# Altium schematic sheet Stack_Rduino-SAMD_V2-PRO_2021-01-03_21-24-34.schdoc
size 321 x 219 mm
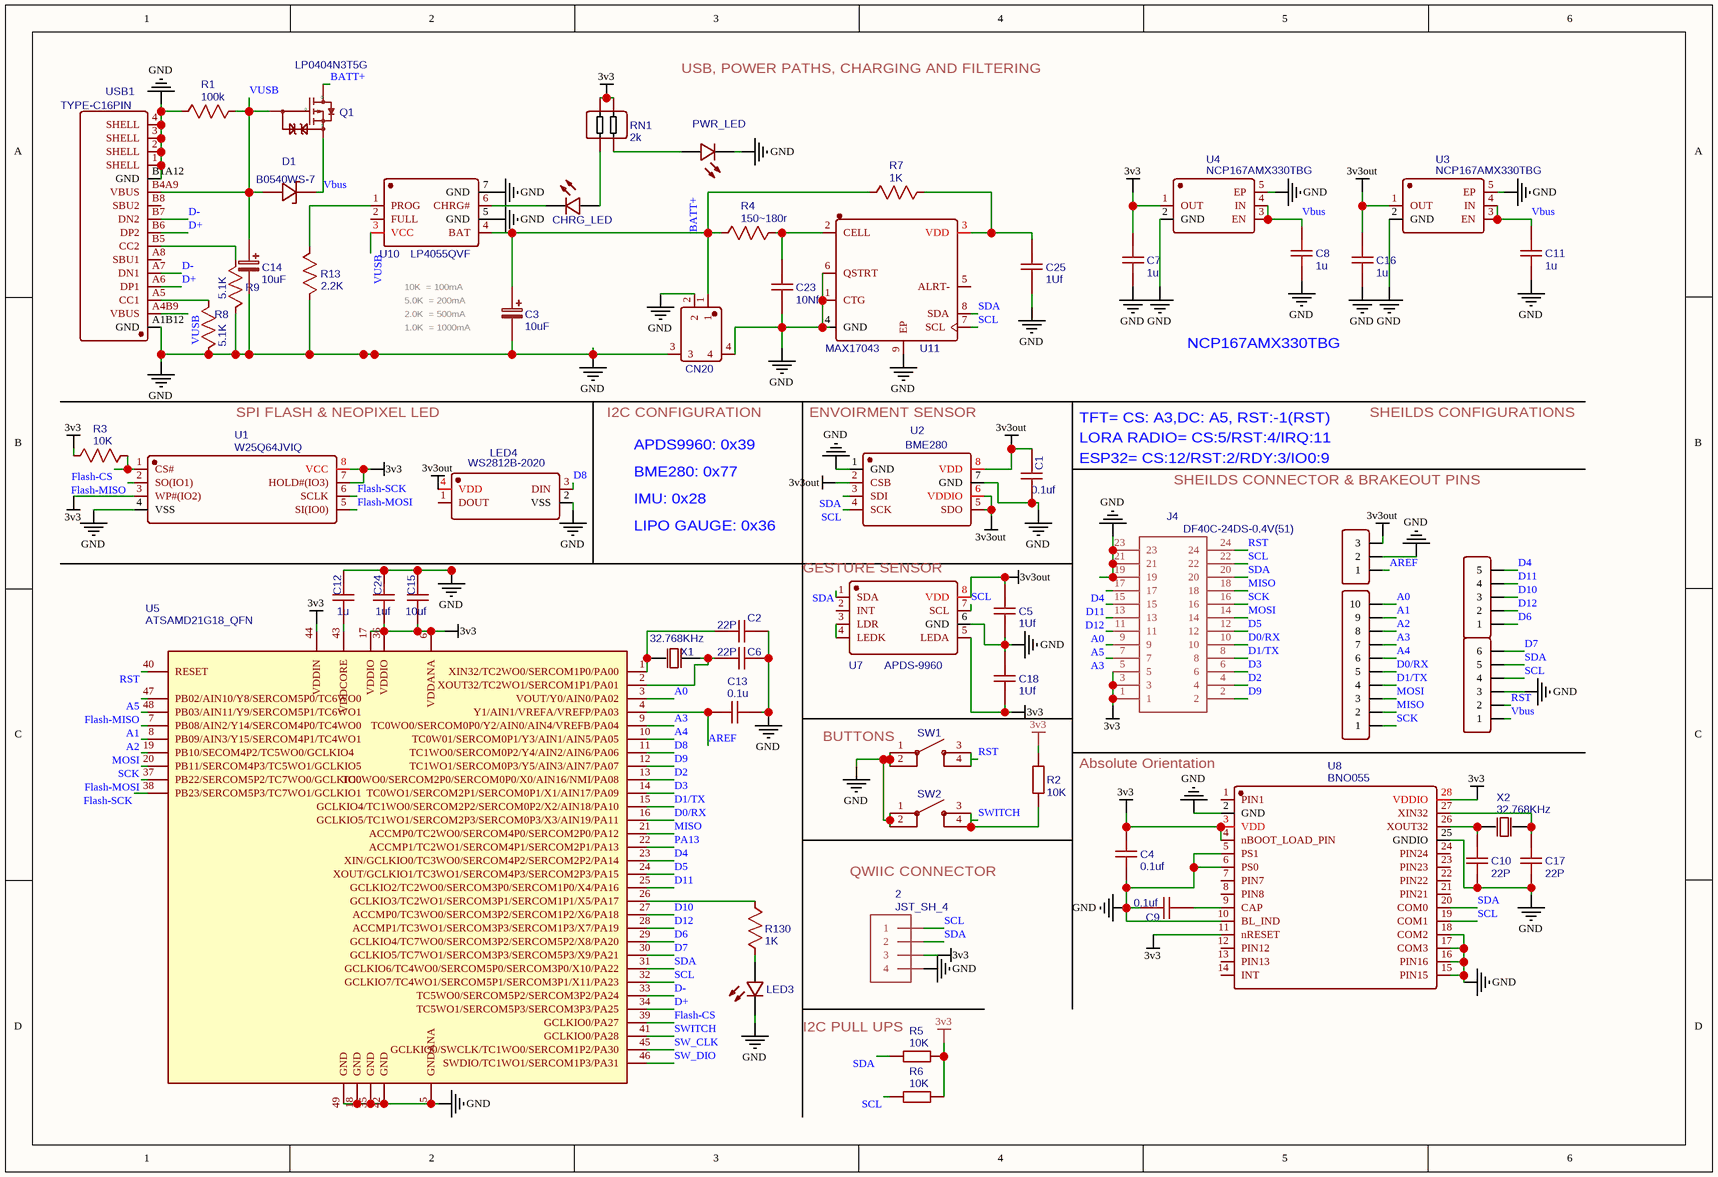
[diagram p0: Stack_Rduino-SAMD_V2-PRO_2021-01-03_21-24-34.schdoc]

## Parts
2  JST_SH_4  [JST_SH_4_SMD]
C1  0.1uf  [C0402]
C2  22P  [C0402]
C3  10uF  [C2012]
C4  0.1uf  [C0402]
C5  1Uf  [C0402]
C6  22P  [C0402]
C7  1u  [C0402]
C8  1u  [C0402]
C9  0.1uf  [C0402]
C10  22P  [C0402]
C11  1u  [C0402]
C12  1u  [C0402]
C13  0.1u  [C0402]
C14  10uF  [C2012]
C15  10uf  [C0402]
C16  1u  [C0402]
C17  22P  [C0402]
C18  1Uf  [C0402]
C23  10Nf  [C0402]
C24  1uf  [C0402]
C25  1Uf  [C0402]
CHRG_LED  Green  [LED0402-RD]  (value not drawn)
CN20  A1002WR-S-2P  [CONN-SMD_A1002WR-S-2P]  (value not drawn)
D1  B0540WS-7  [SOD-323 NARROW_L1.8-W1.3-LS2.5-RD]
H1  HDR-F-2.54_1x5  [HDR-2.54_1X5]  (value not drawn)
H2  HDR-F-2.54_1x6  [HDR-2.54_1X6]  (value not drawn)
H3  HDR-F-2.54_1x10  [HDR-2.54_1X10]  (value not drawn)
J1  HDR-M-2.54_1x3  [HDR-M-2.54_1X3H]  (value not drawn)
J4  DF40C-24DS-0.4V(51)  [DF40C-24DS-0.4V(51)]
LED3  BL-HB337A-AV-TRB  [LED0402-RD]  (value not drawn)
LED4  WS2812B-2020  [WS2812B-2020]
PWR_LED  Red  [LED0402-RD]  (value not drawn)
Q1  LP0404N3T5G  [SOT-883-3_L1.0-W0.6-BR]
R1  100k  [R0402]
R2  10K  [R0402]
R3  10K  [R0402]
R4  150~180r  [R0402]
R5  10K  [R0402]
R6  10K  [R0402]
R7  1K  [R0402]
R8  5.1K  [R0402]
R9  5.1K  [R0402]
R13  2.2K  [R0402]
R130  1K  [R0402]
RN1  2k  [RES-ARRAY-SMD_0402-4P-L1.0-W1.0-BL]
SW1  K2-1177SW-D4DW-06-hany  [KEY-SMD_K2-1177SW-HANY]  (value not drawn)
SW2  K2-1177SW-D4DW-06-hany  [KEY-SMD_K2-1177SW-HANY]  (value not drawn)
U1  W25Q64JVIQ  [USON-8_L4.0-W4.0-P0.8-BL-EP - CUSTOM(4X3)]
U2  BME280  [LGA-8_BME280]
U3  NCP167AMX330TBG  [DFN-4_L1.0-W1.0-P0.65-BL-EP]
U4  NCP167AMX330TBG  [DFN-4_L1.0-W1.0-P0.65-BL-EP]
U5  ATSAMD21G18_QFN  [QFN50P700X700X90-49N]
U7  APDS-9960  [SENSORS-SMD_APDS-9960]
U8  BNO055  [LGA-28_L5.2-W3.8-P0.50-BL]
U10  LP4055QVF  [TDFN-6_L2.0-W2.0-P0.65-TL-EP]
U11  MAX17043  [TDFN-8-EP-2MMX3MM]
USB1  TYPE-C16PIN  [USB-C-SMD_TYPE-C16PIN]
X1  32.768KHz  [FC--12M_L2.0-W1.2]
X2  32.768KHz  [FC--12M_L2.0-W1.2]

## Nets
3v3: 2.3 C4.2 C7.1 C15.1 C18.2 C24.1 J4.1 J4.3 J4.5 R2.1 R3.2 R5.1 R6.2 RN1.1 RN1.2 U1.3(WP#(IO2)) U1.7(HOLD#(IO3)) U1.8(VCC) U4.1(OUT) U5.6(VDDANA) U5.17(VDDIO) U5.36(VDDIO) U5.44(VDDIN) U7.5(LEDA) U8.3(VDD) U8.4(nBOOT_LOAD_PIN) U8.11(nRESET) U8.28(VDDIO)
3v3out: C1.1 C5.1 C16.1 J1.3 LED4.4(VDD) U2.2(CSB) U2.5(SDO) U2.6(VDDIO) U2.8(VDD) U3.1(OUT) U7.8(VDD)
GND: 2.4 C1.2 C2.1 C3.2 C4.1 C5.2 C6.2 C7.2 C8.2 C9.1 C10.2 C11.2 C12.1 C13.1 C14.2 C15.2 C16.2 C17.1 C18.1 C23.1 C24.2 C25.2 CN20.2 CN20.3 CN20.4 H2.3 J1.2 J4.19 J4.21 J4.23 LED3.1(K) LED4.2(VSS) PWR_LED.1(K) R1.1 R8.2 R9.1 R13.2 SW1.1 SW1.2 SW2.1 SW2.2 U1.4(VSS) U2.1(GND) U2.7(GND) U3.2(GND) U3.5(EP) U4.2(GND) U4.5(EP) U5.5(GNDANA) U5.18(GND) U5.35(GND) U5.42(GND) U5.49(GND) U7.6(GND) U8.2(GND) U8.5(PS1) U8.6(PS0) U8.10(BL_IND) U8.15(PIN15) U8.16(PIN16) U8.17(COM3) U8.18(COM2) U8.25(GNDIO) U10.5(GND) U10.7(GND) U11.1(CTG) U11.4(GND) U11.6(QSTRT) U11.9(EP) USB1.1(SHELL) USB1.2(SHELL) USB1.3(SHELL) USB1.4(SHELL) USB1.A1B12(GND) USB1.B1A12(GND)
A0: H3.10 J4.11 U5.3(VOUT/Y0/AIN0/PA02)
A1: H3.9 U5.7(PB08/AIN2/Y14/SERCOM4P0/TC4WO0)
A2: H3.8 U5.8(PB09/AIN3/Y15/SERCOM4P1/TC4WO1)
A3: H3.7 J4.7 U5.9(TC0WO0/SERCOM0P0/Y2/AIN0/AIN4/VREFB/PA04)
A4: H3.6 U5.10(TC0W01/SERCOM0P1/Y3/AIN1/AIN5/PA05)
A5: J4.9 U5.47(PB02/AIN10/Y8/SERCOM5P0/TC6WO0)
AREF: C13.2 J1.1 U5.4(Y1/AIN1/VREFA/VREFP/PA03)
BATT+: C3.1 CN20.1 Q1.3(D) R4.2 R7.2 U10.4(BAT)
D0/RX: H3.5 J4.10 U5.16(GCLKIO5/TC1WO1/SERCOM2P3/SERCOM0P3/X3/AIN19/PA11)
D1/TX: H3.4 J4.8 U5.15(GCLKIO4/TC1WO0/SERCOM2P2/SERCOM0P2/X2/AIN18/PA10)
D2: J4.4 U5.13(TC0WO0/SERCOM2P0/SERCOM0P0/X0/AIN16/NMI/PA08)
D3: J4.6 U5.14(TC0WO1/SERCOM2P1/SERCOM0P1/X1/AIN17/PA09)
D4: H1.5 J4.17 U5.23(XIN/GCLKIO0/TC3WO0/SERCOM4P2/SERCOM2P2/PA14)
D5: J4.12 U5.24(XOUT/GCLKIO1/TC3WO1/SERCOM4P3/SERCOM2P3/PA15)
D6: H1.1 U5.29(GCLKIO4/TC7WO0/SERCOM3P2/SERCOM5P2/X8/PA20)
D7: H2.6 U5.30(GCLKIO5/TC7WO1/SERCOM3P3/SERCOM5P3/X9/PA21)
D8: LED4.3(DIN) U5.11(TC1WO0/SERCOM0P2/Y4/AIN2/AIN6/PA06)
D9: J4.2 U5.12(TC1WO1/SERCOM0P3/Y5/AIN3/AIN7/PA07)
D10: H1.3 U5.27(ACCMP0/TC3WO0/SERCOM3P2/SERCOM1P2/X6/PA18)
D11: H1.4 J4.15 U5.25(GCLKIO2/TC2WO0/SERCOM3P0/SERCOM1P0/X4/PA16)
D12: H1.2 J4.13 U5.28(ACCMP1/TC3WO1/SERCOM3P3/SERCOM1P3/X7/PA19)
D+: U5.34(TC5WO1/SERCOM5P3/SERCOM3P3/PA25) USB1.A6(DP1) USB1.B6(DP2)
D-: U5.33(TC5WO0/SERCOM5P2/SERCOM3P2/PA24) USB1.A7(DN1) USB1.B7(DN2)
Flash-CS: R3.1 U1.1(CS#) U5.39(GCLKIO0/PA27)
Flash-MISO: U1.2(SO(IO1)) U5.48(PB03/AIN11/Y9/SERCOM5P1/TC6WO1)
Flash-MOSI: U1.5(SI(IO0)) U5.37(PB22/SERCOM5P2/TC7WO0/GCLKIO0)
Flash-SCK: U1.6(SCLK) U5.38(PB23/SERCOM5P3/TC7WO1/GCLKIO1)
MISO: H3.2 J4.18 U5.21(ACCMP0/TC2WO0/SERCOM4P0/SERCOM2P0/PA12)
MOSI: H3.3 J4.14 U5.19(PB10/SECOM4P2/TC5WO0/GCLKIO4)
PA13: U5.22(ACCMP1/TC2WO1/SERCOM4P1/SERCOM2P1/PA13)
RST: H2.2 J4.24 SW1.3 SW1.4 U5.40(RESET)
SCK: H3.1 J4.16 U5.20(PB11/SERCOM4P3/TC5WO1/GCLKIO5)
SCL: 2.1 H2.4 J4.22 R6.1 U2.4(SCK) U5.32(GCLKIO7/TC4WO1/SERCOM5P1/SERCOM3P1/X11/PA23) U7.7(SCL) U8.19(COM1) U11.7(SCL)
SDA: 2.2 H2.5 J4.20 R5.2 U2.3(SDI) U5.31(GCLKIO6/TC4WO0/SERCOM5P0/SERCOM3P0/X10/PA22) U7.1(SDA) U8.20(COM0) U11.8(SDA)
SW_CLK: U5.45(GCLKIO0/SWCLK/TC1WO0/SERCOM1P2/PA30)
SW_DIO: U5.46(SWDIO/TC1WO1/SERCOM1P3/PA31)
SWITCH: R2.2 SW2.3 SW2.4 U5.41(GCLKIO0/PA28)
Vbus: C8.1 C11.1 D1.1(C) H2.1 Q1.2(S) U3.3(EN) U3.4(IN) U4.3(EN) U4.4(IN)
VUSB: C14.1 D1.2(A) Q1.1(G) R1.2 U10.3(VCC) USB1.A4B9(VBUS) USB1.B4A9(VBUS)
NetC2_2: C2.2 U5.1(XIN32/TC2WO0/SERCOM1P0/PA00) X1.1(OSC1)
NetC6_1: C6.1 U5.2(XOUT32/TC2WO1/SERCOM1P1/PA01) X1.2(OSC2)
NetC9_2: C9.2 U8.9(CAP)
NetC10_1: C10.1 U8.26(XOUT32) X2.1(OSC1)
NetC12_2: C12.2 U5.43(VDDCORE)
NetC17_2: C17.2 U8.27(XIN32) X2.2(OSC2)
NetC23_2: C23.2 R4.1 U11.2(CELL)
NetC25_1: C25.1 R7.1 U11.3(VDD)
NetCHRG_LED_1: CHRG_LED.1(K) U10.6(CHRG#)
NetCHRG_LED_2: CHRG_LED.2(A) RN1.3
NetLED3_2: LED3.2(A) R130.2
NetPWR_LED_2: PWR_LED.2(A) RN1.4
NetR8_1: R8.1 USB1.A5(CC1)
NetR9_2: R9.2 USB1.B5(CC2)
NetR13_1: R13.1 U10.1(PROG)
NetR130_1: R130.1 U5.26(GCLKIO3/TC2WO1/SERCOM3P1/SERCOM1P1/X5/PA17)
NetU7_3: U7.3(LDR) U7.4(LEDK)

Not connected (* = marked no-connect by the designer): LED4 1(DOUT); U7 2(INT); U8 1(PIN1) 7(PIN7) 8(PIN8) 12(PIN12) 13(PIN13) 14(INT) 21(PIN21) 22(PIN22) 23(PIN23) 24(PIN24); U10 2(FULL); U11 5(ALRT-); USB1 A8(SBU1) B8(SBU2)

## Notes on the sheet
- USB, POWER PATHS, CHARGING AND FILTERING
- 2.0K  = 500mA
- 5.0K  = 200mA
- 10K  = 100mA
- (near C3) 1.0K  = 1000mA
- NCP167AMX330TBG
- SPI FLASH & NEOPIXEL LED
- I2C CONFIGURATION
- APDS9960: 0x39
- ENVOIRMENT SENSOR
- TFT= CS: A3,DC: A5, RST:-1(RST)
- (near C1) LORA RADIO= CS:5/RST:4/IRQ:11
- SHEILDS CONFIGURATIONS
- BME280: 0x77
- IMU: 0x28
- (near C1) ESP32= CS:12/RST:2/RDY:3/IO0:9
- SHEILDS CONNECTOR & BRAKEOUT PINS
- LIPO GAUGE: 0x36
- (near U7) GESTURE SENSOR
- (near SW1) BUTTONS
- Absolute Orientation
- QWIIC CONNECTOR
- (near R5) I2C PULL UPS

## Library data of the parts
2 = JST_SH_4: Contributor: guerwood; spicePre: ?; spiceSymbolName: JST_SH_4
C1 C4 C9 = 0.1uf: nameAlias: Value(F); Contributor: LCEDA_Lib; spicePre: C; spiceSymbolName: C_0805_US
C2 C6 C10 C17 = 22P: nameAlias: Value(F); Contributor: LCEDA_Lib; spicePre: C; spiceSymbolName: C_0805_US
C3 C14 = 10uF: BOM_Manufacturer: AVX; BOM_Manufacturer Part: TACL106M006XTA; nameAlias: Capacitance; Contributor: LCSC; BOM_Supplier: LCSC; BOM_Supplier Part: C597677; spicePre: C; spiceSymbolName: TACL106M006XTA
C5 C18 C25 = 1Uf: nameAlias: Value(F); Contributor: LCEDA_Lib; spicePre: C; spiceSymbolName: C_0805_US
C7 C8 C11 C12 C16 = 1u: nameAlias: Value(F); Contributor: LCEDA_Lib; spicePre: C; spiceSymbolName: C_0805_US
C13 = 0.1u: nameAlias: Value(F); Contributor: LCEDA_Lib; spicePre: C; spiceSymbolName: C_0805_US
C15 = 10uf: nameAlias: Value(F); Contributor: LCEDA_Lib; spicePre: C; spiceSymbolName: C_0805_US
C23 = 10Nf: nameAlias: Value(F); Contributor: LCEDA_Lib; spicePre: C; spiceSymbolName: C_0805_US
C24 = 1uf: nameAlias: Value(F); Contributor: LCEDA_Lib; spicePre: C; spiceSymbolName: C_0805_US
CHRG_LED = Green: BOM_Manufacturer: BrtLed; BOM_Manufacturer Part: BL-HB337A-AV-TRB; Contributor: LCSC; BOM_Supplier: LCSC; BOM_Supplier Part: C165977; spicePre: L; spiceSymbolName: BL-HB337A-AV-TRB
CN20 = A1002WR-S-2P: BOM_Manufacturer: Changjiang Connectors; Contributor: LCSC; BOM_Supplier: LCSC; BOM_Supplier Part: C239520; BOM_Manufacturer Part: A1002WR-S-2P; spicePre: C; spiceSymbolName: A1002WR-S-2P
D1 = B0540WS-7: BOM_Manufacturer: DIODES; Contributor: LCSC; SMT Type: Extend; BOM_Supplier: LCSC; BOM_Supplier Part: C98664; BOM_Manufacturer Part: B0540WS-7; BOM_LCSC Assembly: Yes; spicePre: D; spiceSymbolName: 1N5819WS
H1 = HDR-F-2.54_1x5: Contributor: LCEDA_Lib; Package Display: No; BOM_Supplier Part: C50950; BOM_Supplier: LCSC; spicePre: H; spiceSymbolName: HDR-F-2.54_1x5
H2 = HDR-F-2.54_1x6: Contributor: LCEDA_Lib; BOM_Supplier Part: C40877; BOM_Supplier: LCSC; spicePre: H; spiceSymbolName: HDR-F-2.54_1x6
H3 = HDR-F-2.54_1x10: Contributor: LCEDA_Lib; BOM_Supplier Part: C35445; BOM_Supplier: LCSC; spicePre: H; spiceSymbolName: HDR-F-2.54_1x10
J1 = HDR-M-2.54_1x3: Contributor: LCEDA_Lib; BOM_Supplier Part: C180248; BOM_Supplier: LCSC; spicePre: J; spiceSymbolName: HDR-M-2.54_1x3
J4 = DF40C-24DS-0.4V(51): BOM_Manufacturer: HRS(Hirose); Contributor: Hany_elkomy; BOM_Manufacturer Part: DF40C-24DS-0.4V(51); BOM_Supplier: LCSC; BOM_Supplier Part: C424640; link: https://lcsc.com/product-detail/Mezzanine-Connectors-Board-to-Board_HRS-Hirose_DF40C-24DS-0-4V-51_HRS-Hirose-HRS-DF40C-24DS-0-4V-51_C424640.html; spicePre: J; spiceSymbolName: DF40C-24DS-0.4V(51)
LED3 = BL-HB337A-AV-TRB: BOM_Manufacturer: BrtLed; Contributor: LCSC; BOM_Supplier: LCSC; BOM_Manufacturer Part: BL-HB337A-AV-TRB; BOM_Supplier Part: C165977; spicePre: L; spiceSymbolName: BL-HB337A-AV-TRB
LED4 = WS2812B-2020: BOM_Manufacturer: Worldsemi; Contributor: spatz; BOM_Supplier: LCSC; BOM_Manufacturer Part: WS2812B; BOM_Supplier Part: C114585; spicePre: L; spiceSymbolName: WS2812B-2020 copy
PWR_LED = Red: BOM_Manufacturer: BrtLed; BOM_Manufacturer Part: BL-HB337A-AV-TRB; Contributor: LCSC; BOM_Supplier: LCSC; BOM_Supplier Part: C165977; spicePre: L; spiceSymbolName: BL-HB337A-AV-TRB
Q1 = LP0404N3T5G: BOM_Manufacturer: LRC; Contributor: LCSC; BOM_Supplier: LCSC; BOM_Manufacturer Part: LP0404N3T5G; BOM_Supplier Part: C172433; spicePre: Q; spiceSymbolName: LP0404N3T5G
R1 = 100k: nameAlias: Value(Ω); Contributor: LCEDA_Lib; spicePre: R; spiceSymbolName: R_0805_US
R2 R5 R6 = 10K: BOM_Manufacturer: YAGEO; BOM_Manufacturer Part: RC0603FR-0739KL; nameAlias: Resistance (Ohms); Contributor: LCSC; BOM_Supplier: LCSC; BOM_Supplier Part: C163424; spicePre: R; spiceSymbolName: RC0603FR-0739KL
R3 = 10K: nameAlias: Value(Ω); Contributor: LCEDA_Lib; spicePre: R; spiceSymbolName: R_0805_US
R4 = 150~180r: nameAlias: Value(Ω); Contributor: LCEDA_Lib; spicePre: R; spiceSymbolName: R_0805_US
R7 R130 = 1K: nameAlias: Value(Ω); Contributor: LCEDA_Lib; spicePre: R; spiceSymbolName: R_0805_US
R8 R9 = 5.1K: nameAlias: Value(Ω); Contributor: LCEDA_Lib; spicePre: R; spiceSymbolName: R_0603_US
R13 = 2.2K: nameAlias: Value(Ω); Contributor: LCEDA_Lib; spicePre: R; spiceSymbolName: R_0603_US
RN1 = 2k: BOM_Manufacturer: YAGEO; BOM_Manufacturer Part: YC122-JR-072K; nameAlias: Resistance (Ohms); Contributor: LCSC; BOM_Supplier: LCSC; BOM_Supplier Part: C718251; spicePre: R; spiceSymbolName: 2D02WGF1500TCE
SW1 SW2 = K2-1177SW-D4DW-06-hany: BOM_Manufacturer: Korean Hroparts Elec; Contributor: Hany_elkomy; BOM_Supplier: LCSC; BOM_Supplier Part: C223820; BOM_Manufacturer Part: K2-1177SW-D4DW-06; spicePre: S; spiceSymbolName: K2-1177SW-D4DW-06-hany
U1 = W25Q64JVIQ: BOM_Manufacturer: GigaDevice Semicon Beijing; BOM_Manufacturer Part: GD25Q64CQIGR; Contributor: LCSC; BOM_Supplier: LCSC; BOM_Supplier Part: C395538; spicePre: U; spiceSymbolName: GD25Q64CQIGR
U2 = BME280: BOM_Manufacturer: Bosch; Contributor: LCSC; BOM_Supplier: LCSC; BOM_Manufacturer Part: BME280; BOM_Supplier Part: C92489; spicePre: U; spiceSymbolName: BME280
U3 U4 = NCP167AMX330TBG: BOM_Manufacturer: ON; BOM_Manufacturer Part: NCP170AMX300TCG; Contributor: LCSC; BOM_Supplier: LCSC; BOM_Supplier Part: C152284; spicePre: U; spiceSymbolName: NCP170AMX300TCG
U5 = ATSAMD21G18_QFN: Contributor: corlovsky; license: https://www.gnu.org/licenses/lgpl-2.1.html; spicePre: U; spiceSymbolName: ATSAMD21G18_QFN
U7 = APDS-9960: BOM_Manufacturer: AVAGO; Contributor: LCSC; BOM_Supplier: LCSC; BOM_Manufacturer Part: APDS-9960; BOM_Supplier Part: C93222; spicePre: U; spiceSymbolName: APDS-9960
U8 = BNO055: BOM_Manufacturer: Bosch Sensortec; Contributor: LCSC; BOM_Supplier: LCSC; BOM_Supplier Part: C93216; BOM_Manufacturer Part: BNO055; spicePre: U; spiceSymbolName: BNO055
U10 = LP4055QVF: BOM_Manufacturer: LOWPOWER; Contributor: LCSC; SMT Type: Extend; BOM_Supplier: LCSC; BOM_Supplier Part: C387714; BOM_Manufacturer Part: LP4055QVF; BOM_LCSC Assembly: Yes; spicePre: U; spiceSymbolName: LP4055QVF
U11 = MAX17043: BOM_Manufacturer Part: MAX17043G+U; Contributor: whatski; spicePre: U; spiceSymbolName: MAX17043
USB1 = TYPE-C16PIN: BOM_Manufacturer: SHOU HAN; Contributor: LCSC; BOM_Supplier: LCSC; BOM_Supplier Part: C393939; BOM_Manufacturer Part: TYPE-C16PIN; spicePre: U; spiceSymbolName: TYPE-C16PIN
X1 X2 = 32.768KHz: BOM_Manufacturer: EPSON; BOM_Manufacturer Part: FC-12M32.768KHZ7PF20PPM; nameAlias: Frequency; SMT Type: Extend; BOM_Supplier: LCSC; BOM_Supplier Part: C99009; BOM_LCSC Assembly: Yes; spicePre: X; spiceSymbolName: FC-12M32.768KHZ7PF20PPM